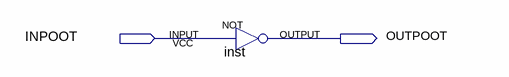
[diagram p0: schematic sheet]
// Quartus schematic simpleprogram.bdf as structural Verilog: 1 symbols, 2 pins
module simpleprogram (
  input  INPOOT,
  output OUTPOOT
);

  not inst (OUTPOOT, INPOOT);
endmodule
